# Altium schematic sheet INDEX.SchDoc: INDEX
size 420 x 297 mm; Date: March 14; CheckedBy: ThS. Bùi Quốc Bảo; DrawnBy: Nguyễn Gia Huy; Revision: V1.0; SheetNumber: 2; SheetTotal: 5; MasterProject: 2LEDs Dice game; Sub-system: 2LED_Dice.PrjPcb
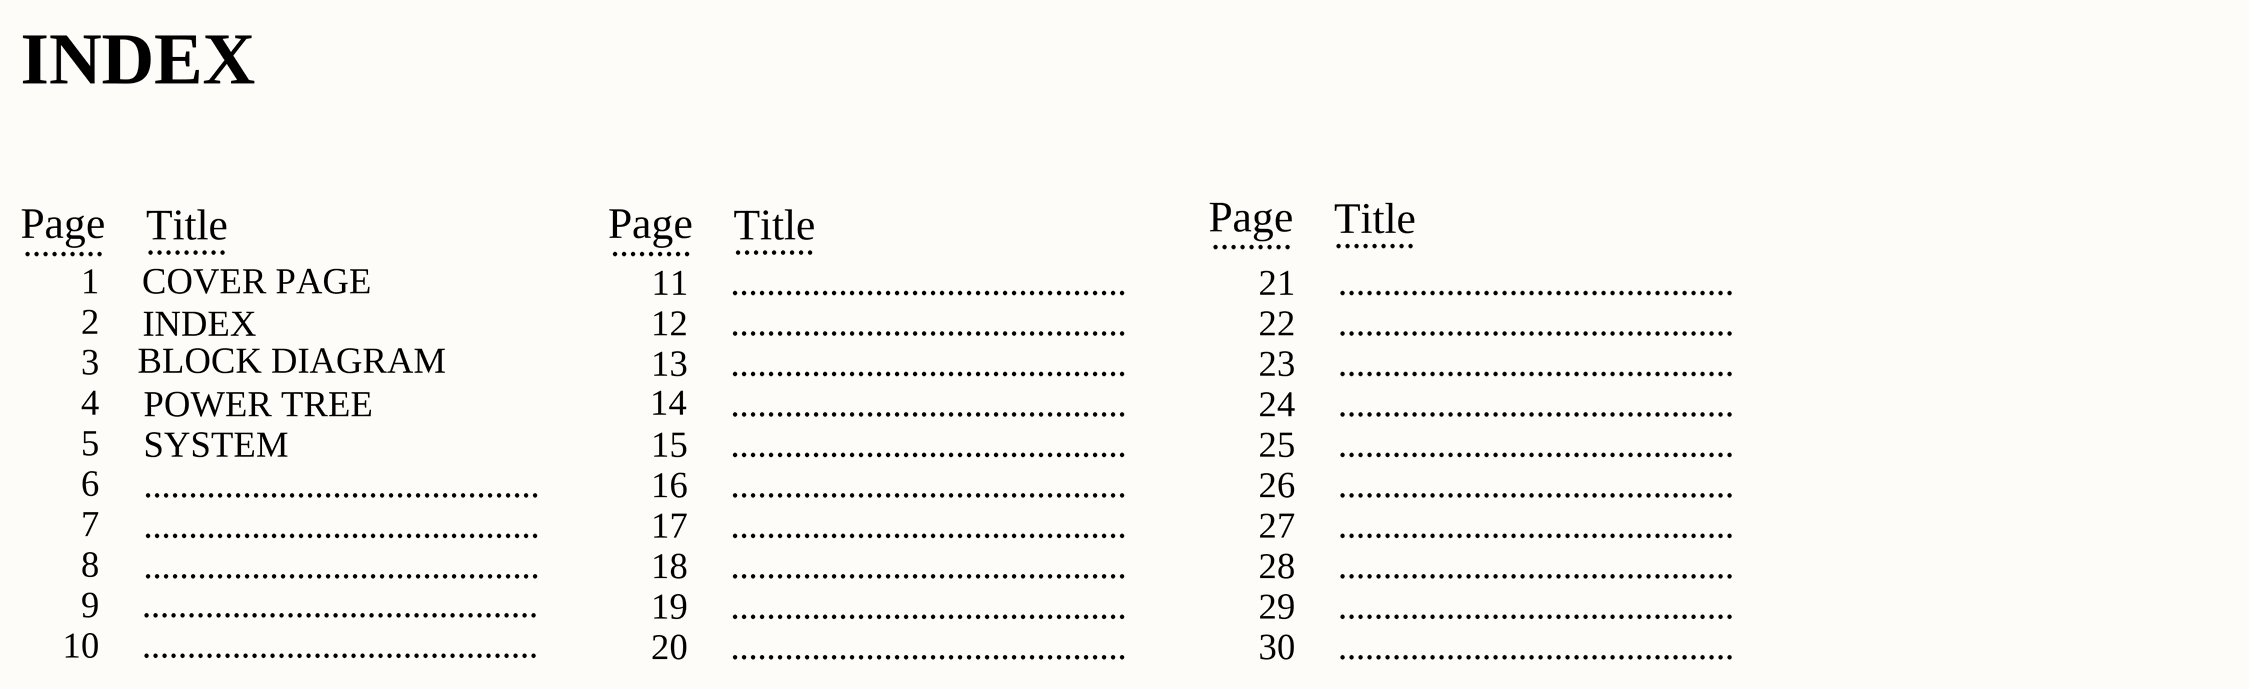
[diagram p0: INDEX.SchDoc]

## Notes on the sheet
- INDEX
- Page
- .........
- Title
- 1
- COVER PAGE
- 11
- ............................................
- 21
- 2
- 3
- BLOCK DIAGRAM
- 12
- 13
- 22
- 23
- 4
- 5
- POWER TREE
- SYSTEM
- 14
- 15
- 24
- 25
- 6
- 16
- 26
- 7
- 8
- 17
- 18
- 27
- 28
- 9
- 10
- 19
- 20
- 29
- 30
- Sub-system:
- Project:
- Design by:
- Sheet title:
- Sheet
- of
- Checked by:
- Approved by:
- Doc No:
- Revision:
- Size:
- Dates:
- A3